# EAGLE design OakyWing-v0.1 (EAGLE 9.5.2)
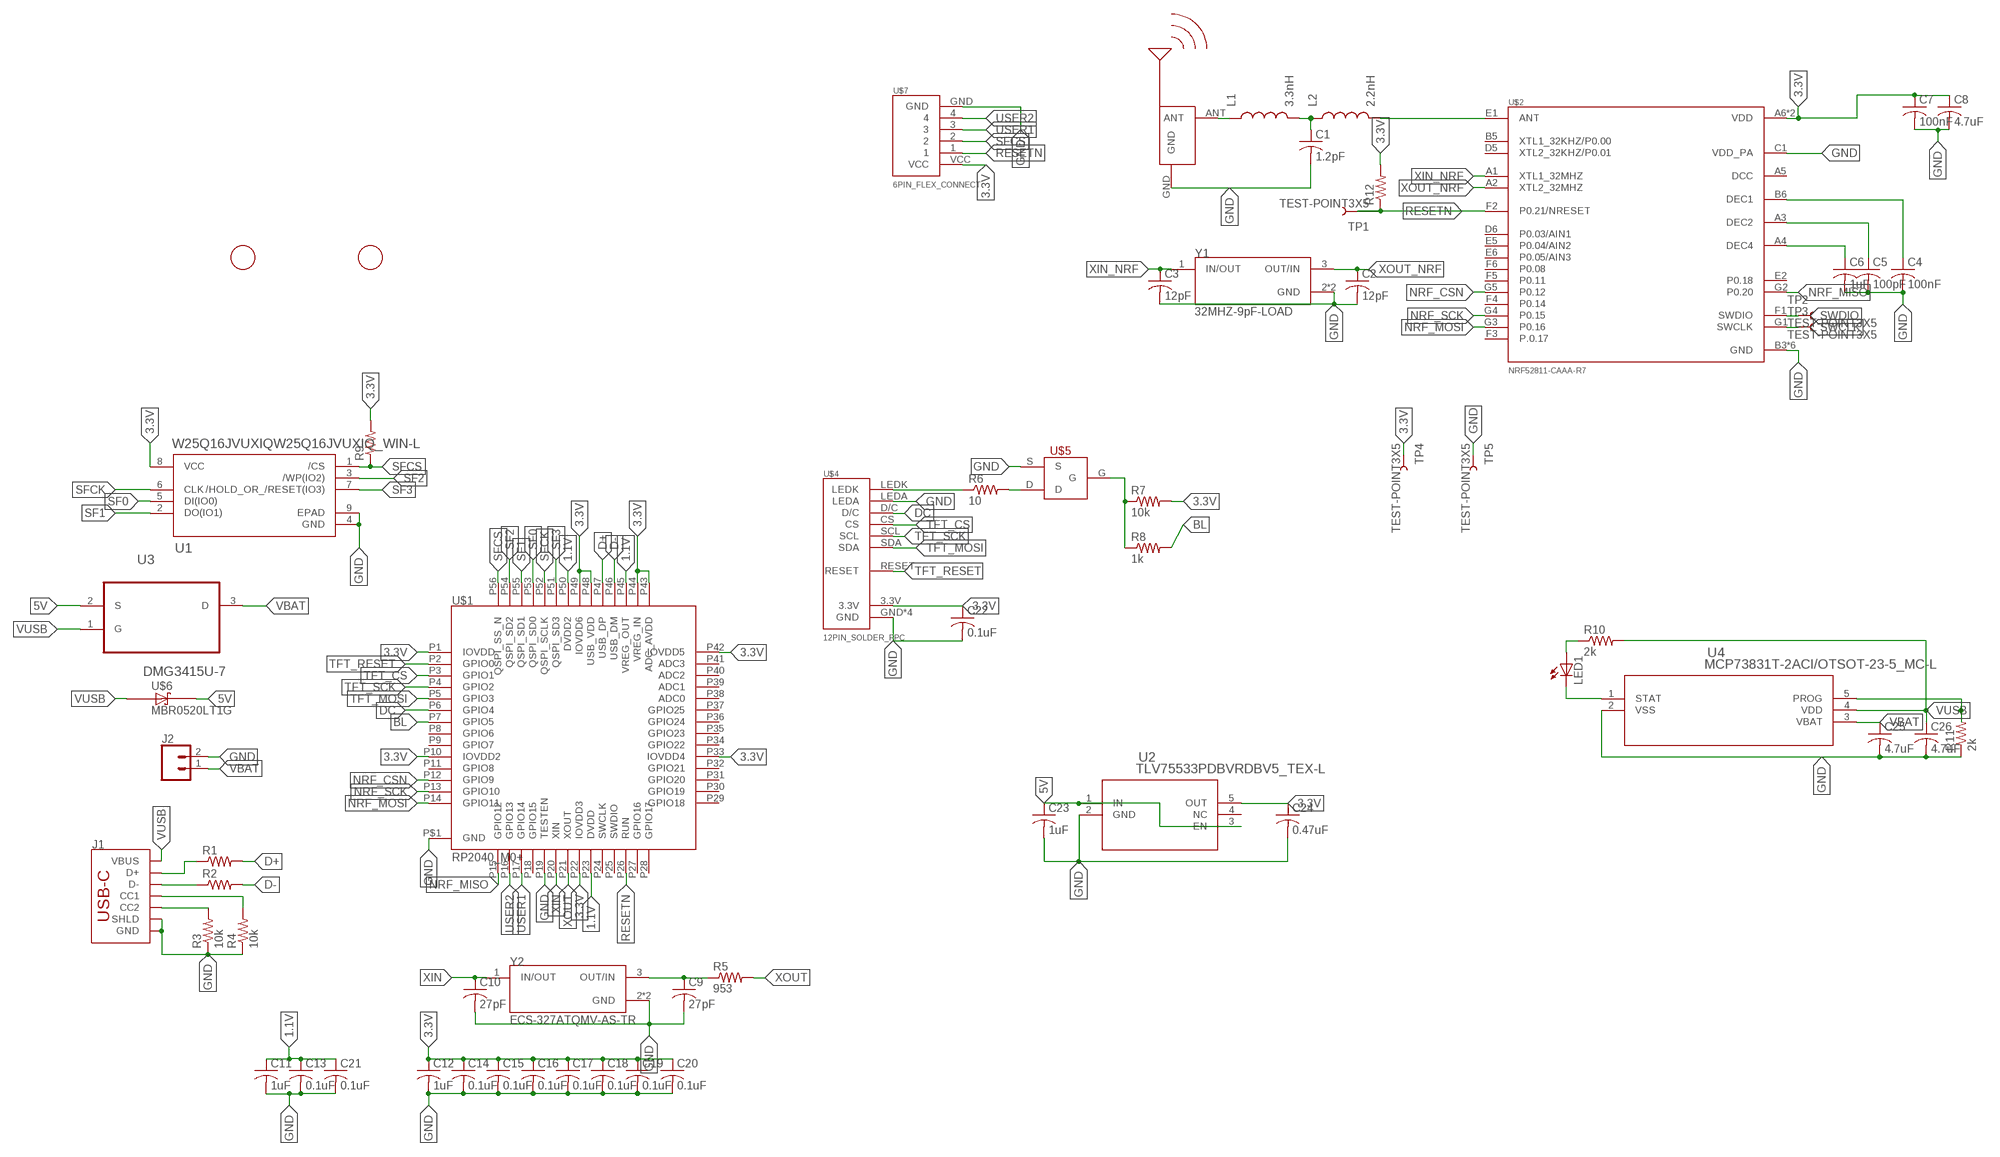
[diagram p0: schematic, sheet 1]

## Parts
C1  1.2pF  C-USC0402  [C0402]
C2  12pF  C-USC0402  [C0402]
C3  12pF  C-USC0402  [C0402]
C4  100nF  C-USC0402  [C0402]
C5  100pF  C-USC0402  [C0402]
C6  1uF  C-USC0402  [C0402]
C7  100nF  C-USC0402  [C0402]
C8  4.7uF  C-USC0603  [C0603]
C9  27pF  C-USC0402  [C0402]
C10  27pF  C-USC0402  [C0402]
C11  1uF  C-USC0402  [C0402]
C12  1uF  C-USC0402  [C0402]
C13  0.1uF  C-USC0402  [C0402]
C14  0.1uF  C-USC0402  [C0402]
C15  0.1uF  C-USC0402  [C0402]
C16  0.1uF  C-USC0402  [C0402]
C17  0.1uF  C-USC0402  [C0402]
C18  0.1uF  C-USC0402  [C0402]
C19  0.1uF  C-USC0402  [C0402]
C20  0.1uF  C-USC0402  [C0402]
C21  0.1uF  C-USC0402  [C0402]
C22  0.1uF  C-USC0402  [C0402]
C23  1uF  C-USC0402  [C0402]
C24  0.47uF  C-USC0402  [C0402]
C25  4.7uF  C-USC0603  [C0603]
C26  4.7uF  C-USC0603  [C0603]
J1  USB_C_2-LAYER_PADS  [USB-C-16P-2LAYER-PADS]
J2  CONN_02  [1X02]
L1  3.3nH  INDUCTOR  [R0402]
L2  2.2nH  INDUCTOR  [R0402]
LED1  LEDCHIP-LED0603  [CHIP-LED0603]
R1  R-US_R0603  [R0603]
R2  R-US_R0603  [R0603]
R3  10k  R-US_R0402  [R0402]
R4  10k  R-US_R0402  [R0402]
R5  953  R-US_R0402  [R0402]
R6  10  R-US_R0402  [R0402]
R7  10k  R-US_R0402  [R0402]
R8  1k  R-US_R0402  [R0402]
R9  R-US_R0402  [R0402]
R10  2k  R-US_R0603  [R0603]
R11  2k  R-US_R0603  [R0603]
R12  R-US_R0402  [R0402]
TP1  TEST-POINT3X5  [PAD.03X.05]
TP2  TEST-POINT3X5  [PAD.03X.05]
TP3  TEST-POINT3X5  [PAD.03X.05]
TP4  TEST-POINT3X5  [PAD.03X.05]
TP5  TEST-POINT3X5  [PAD.03X.05]
U1  W25Q16JVUXIQW25Q16JVUXIQ_WIN-L  [W25Q16JVUXIQ_WIN-L]
U2  TLV75533PDBVRDBV5_TEX-L  [DBV5_TEX-L]
U3  DMG3415U-7  [SOT95P240X105-3N]
U4  MCP73831T-2ACI/OTSOT-23-5_MC-L  [SOT-23-5_MC-L]
U$1  RP2040_M0+  [QFN-56]
U$2  NRF52811-CAAA-R7  [WLCSP]
U$3  BLE-2.45GHZ-ANTBLE-2.45GHZ-SERP-ANT  [2.45GHZ-SERPENTINE]
U$4  12PIN_SOLDER_FPC  [12PIN_SOLDER_FPC]
U$5  DMN65D8L-7  [SOT-23]
U$6  MBR0520LT1G  [SOD3716X117(SOD-123)]
U$7  6PIN_FLEX_CONNECT  [6PIN_0.7MM]
U$8  FIDUCIAL  [FIDUCIAL_1MM]
U$9  FIDUCIAL  [FIDUCIAL_1MM]
Y1  32MHZ-9pF-LOAD  ECS-327ATQMV-AS-TR  [XTAL_ECS-327ATQMV-AS-TR]
Y2  ECS-327ATQMV-AS-TR  [XTAL_ECS-327ATQMV-AS-TR]

## Nets
1.1V: C11.1 C13.1 C21.1 U$1.P23(DVDD) U$1.P45(VREG_OUT) U$1.P50(DVDD2)
3.3V: C7.1 C8.1 C12.1 C14.1 C15.1 C16.1 C17.1 C18.1 C19.1 C20.1 C22.1 C24.1 R7.2 R9.2 R12.2 TP4.P$1 U1.8(VCC) U2.5(OUT) U$1.P1(IOVDD) U$1.P10(IOVDD2) U$1.P22(IOVDD3) U$1.P33(IOVDD4) U$1.P42(IOVDD5) U$1.P43(ADC_AVDD) U$1.P44(VREG_IN) U$1.P48(USB_VDD) U$1.P49(IOVDD6) U$2.A6(VDD) U$2.G6(VDD) U$4.3.3V U$7.VCC
5V: C23.1 U2.1(IN) U2.3(EN) U3.2(S) U$6.1(C)
BL: R8.2 U$1.P7(GPIO5)
D+: R1.2 U$1.P47(USB_DP)
D-: R2.2 U$1.P46(USB_DM)
DC: U$1.P6(GPIO4) U$4.D/C
GND: C1.2 C2.2 C3.2 C4.2 C5.2 C6.2 C7.2 C8.2 C9.2 C10.2 C11.2 C12.2 C13.2 C14.2 C15.2 C16.2 C17.2 C18.2 C19.2 C20.2 C21.2 C22.2 C23.2 C24.2 C25.2 C26.2 J1.GND J1.GND2(GND) J1.P$1(SHLD) J1.P$2(SHLD) J1.P$3(SHLD) J1.P$4(SHLD) J1.SHLD1(SHLD) J1.SHLD2(SHLD) J1.SHLD3(SHLD) J1.SHLD4(SHLD) J2.2 R3.1 R4.1 R11.1 TP5.P$1 U1.4(GND) U1.9(EPAD) U2.2(GND) U4.2(VSS) U$1.P19(TESTEN) U$1.P$1(GND) U$2.B3(GND) U$2.B4(GND) U$2.C1(VDD_PA) U$2.D3(GND) U$2.D4(GND) U$2.E3(GND) U$2.E4(GND) U$3.GND U$4.GND U$4.GND2(GND) U$4.GND3(GND) U$4.GND4(GND) U$4.LEDA U$5.S U$7.GND Y1.2(GND) Y1.4(GND) Y2.2(GND) Y2.4(GND)
N$5: L2.2 U$2.E1(ANT)
N$6: C1.1 L1.2 L2.1
N$7: L1.1 U$3.ANT
N$8: C4.1 U$2.B6(DEC1)
N$9: C5.1 U$2.A3(DEC2)
N$11: C6.1 U$2.A4(DEC4)
N$12: C9.1 R5.1 Y2.3(OUT/IN)
N$13: J1.A6(D+) J1.B6(D+) R1.1
N$14: J1.A7(D-) J1.B7(D-) R2.1
N$15: J1.A5(CC1) R4.2
N$16: J1.B5(CC2) R3.2
N$17: R7.1 R8.1 U$5.G
N$18: R6.2 U$5.D
N$21: R6.1 U$4.LEDK
N$22: LED1.C U4.1(STAT)
N$23: R11.2 U4.5(PROG)
N$24: LED1.A R10.1
NRF_CSN: U$1.P12(GPIO9) U$2.G5(P0.12)
NRF_MISO: U$1.P15(GPIO12) U$2.G2(P0.20)
NRF_MOSI: U$1.P14(GPIO11) U$2.G3(P0.16)
NRF_SCK: U$1.P13(GPIO10) U$2.G4(P0.15)
RESETN: R12.1 TP1.P$1 U$1.P26(RUN) U$2.F2(P0.21/NRESET) U$7.1
SF0: U1.5(DI(IO0)) U$1.P53(QSPI_SD0)
SF1: U1.2(DO(IO1)) U$1.P55(QSPI_SD1)
SF2: U1.3(/WP(IO2)) U$1.P54(QSPI_SD2)
SF3: U1.7(/HOLD_OR_/RESET(IO3)) U$1.P51(QSPI_SD3)
SFCK: U1.6(CLK) U$1.P52(QSPI_SCLK)
SFCS: R9.1 U1.1(/CS) U$1.P56(QSPI_SS_N) U$7.2
SWCLK: TP3.P$1 U$2.G1(SWCLK)
SWDIO: TP2.P$1 U$2.F1(SWDIO)
TFT_CS: U$1.P3(GPIO1) U$4.CS
TFT_MOSI: U$1.P5(GPIO3) U$4.SDA
TFT_RESET: U$1.P2(GPIO0) U$4.RESET
TFT_SCK: U$1.P4(GPIO2) U$4.SCL
USER1: U$1.P17(GPIO14) U$7.3
USER2: U$1.P16(GPIO13) U$7.4
VBAT: C25.1 J2.1 U3.3(D) U4.3(VBAT)
VUSB: C26.1 J1.VBUS1(VBUS) J1.VBUS2(VBUS) R10.2 U3.1(G) U4.4(VDD) U$6.2(A)
XIN: C10.1 U$1.P20(XIN) Y2.1(IN/OUT)
XIN_NRF: C3.1 U$2.A1(XTL1_32MHZ) Y1.1(IN/OUT)
XOUT: R5.2 U$1.P21(XOUT)
XOUT_NRF: C2.1 U$2.A2(XTL2_32MHZ) Y1.3(OUT/IN)
Unconnected: U2.4(NC) U$1.P8(GPIO6) U$1.P9(GPIO7) U$1.P11(GPIO8) U$1.P18(GPIO15) U$1.P24(SWCLK) U$1.P25(SWDIO) U$1.P27(GPIO16) U$1.P28(GPIO17) U$1.P29(GPIO18) U$1.P30(GPIO19) U$1.P31(GPIO20) U$1.P32(GPIO21) U$1.P34(GPIO22) U$1.P35(GPIO23) U$1.P36(GPIO24) U$1.P37(GPIO25) U$1.P38(ADC0) U$1.P39(ADC1) U$1.P40(ADC2) U$1.P41(ADC3) U$2.A5(DCC) U$2.B5(XTL1_32KHZ/P0.00) U$2.D5(XTL2_32KHZ/P0.01) U$2.D6(P0.03/AIN1) U$2.E2(P0.18) U$2.E5(P0.04/AIN2) U$2.E6(P0.05/AIN3) U$2.F3(P.0.17) U$2.F4(P0.14) U$2.F5(P0.11) U$2.F6(P0.08)

## Library data of the parts
C1 C2 C4-C8 C22-C26 = rcl:C-US: CAPACITOR, American symbol; SPICEPREFIX: C
C3 C9-C21 = adafruit:C-US: CAPACITOR, American symbol
J1 = SparkFun-Connectors:USB_C: USB Type C 16Pin Connector Super Speed pins not available on the 16-pin purely SMD connector so this part is best for USB 2.0 implementations. D1 and D2 are tied together enabling D+/- no matter which way the cable is plugged into the connector. The two channel configuration pins (CC1/2) are exposed. These are normally connected to ground via 5.1k resistors but can be reconfigured for high current/high power applications.; PROD_ID: CONN-14122
J2 = SparkFun-Connectors:CONN_02: Multi connection point. Often used as Generic Header-pin footprint for 0.1 inch spaced/style header connections On any of the 0.1 inch spaced packages, you can populate with these: Break Away Headers - Straight <https://www.sparkfun.com/products/116> (PRT-00116) Break Away Male Headers - Right Angle <https://www.sparkfun.com/products/553> (PRT-00553) Female Headers <https://www.sparkfun.com/products/115> (PRT-00115) Break Away Headers - Machine Pin <https://www.sparkfun.com/products/117> (PRT-00117) Break Away Female Headers - Swiss Machine Pin <https://www.sparkfun.com/products/743> (PRT-00743) For SCREWTERMINALS and SPRING TERMINALS visit here: Screw Terimnals on SparkFun.com <https://www.sparkfun.com/search/results?term=Screw+Terminals> (5mm/3.5mm/2.54mm spacing) This device is also useful as a general connection point to wire up your design to another part of your project. Our various solder wires solder well into these plated through hole pads. Hook-Up Wire - Assortment (Stranded, 22 AWG) <https://www.sparkfun.com/products/11375> (PRT-11375) Hook-Up Wire - Assortment (Solid Core, 22 AWG) <https://www.sparkfun.com/products/11367> (PRT-11367) View the entire wire category on our website here <https://www.sparkfun.com/categories/141> Special notes: Molex polarized connector foot print use with: PRT-08233 with associated crimp pins and housings. 2.54_SCREWTERM for use with PRT-10571. 3.5mm Screw Terminal footprints for PRT-08084 5mm Screw Terminal footprints for use with PRT-08432
L1 L2 = Chip_Inductors:INDUCTOR
LED1 = adafruit:LED: LED OSRAM: - CHIPLED LG R971, LG N971, LY N971, LG Q971, LY Q971, LO R971, LY R971 LH N974, LH R974 LS Q976, LO Q976, LY Q976 LO Q996 - Hyper CHIPLED LW Q18S LB Q993, LB Q99A, LB R99A - SideLED LS A670, LO A670, LY A670, LG A670, LP A670 LB A673, LV A673, LT A673, LW A673 LH A674 LY A675 LS A676, LA A676, LO A676, LY A676, LW A676 LS A679, LY A679, LG A679 - Hyper Micro SIDELED® LS Y876, LA Y876, LO Y876, LY Y876 LT Y87S - SmartLED LW L88C, LW L88S LB L89C, LB L89S, LG L890 LS L89K, LO L89K, LY L89K LS L896, LA L896, LO L896, LY L896 - TOPLED LS T670, LO T670, LY T670, LG T670, LP T670 LSG T670, LSP T670, LSY T670, LOP T670, LYG T670 LG T671, LOG T671, LSG T671 LB T673, LV T673, LT T673, LW T673 LH T674 LS T676, LA T676, LO T676, LY T676, LB T676, LH T676, LSB T676, LW T676 LB T67C, LV T67C, LT T67C, LS T67K, LO T67K, LY T67K, LW E67C LS E67B, LA E67B, LO E67B, LY E67B, LB E67C, LV E67C, LT E67C LW T67C LS T679, LY T679, LG T679 LS T770, LO T770, LY T770, LG T770, LP T770 LB T773, LV T773, LT T773, LW T773 LH T774 LS E675, LA E675, LY E675, LS T675 LS T776, LA T776, LO T776, LY T776, LB T776 LHGB T686 LT T68C, LB T68C - Hyper Mini TOPLED® LB M676 - Mini TOPLED Santana® LG M470 LS M47K, LO M47K, LY M47K Source: http://www.osram.convergy.de/
R1 R2 R6-R12 = rcl:R-US_: RESISTOR, American symbol; SPICEPREFIX: R
R3-R5 = adafruit:R-US_: RESISTOR, American symbol
TP1-TP5 = SparkFun-Connectors:TEST-POINT: SparkFun Test Points Bare copper test points for troubleshooting or In-Circuit-Testing. These are used by our Production team for verifying production board runs using pogo-pins on test beds. SparkFun Products: SparkFun LSM9DS1 Breakout <https://www.sparkfun.com/products/13284> SparkFun PSOC <https://www.sparkfun.com/products/13714> SparkFun Load Cell Amplifier <https://www.sparkfun.com/products/13879>
U1 = Winbond SPI Flash:W25Q16JVUXIQ; BUILT_BY: EMA_Colton; COPYRIGHT: Copyright (C) 2018 Accelerated Designs. All rights reserved; DATASHEET: https://www.mouser.com/datasheet/2/949/w25n01gw_reve_021318_unsecured-1489855.pdf; MANUFACTURER_PART_NUMBER: W25Q16JVUXIQ; SOURCELIBRARY: Winbond_2020-03-18; VENDOR: Winbond
U2 = TLV75533pdbvr:TLV75533PDBVR; COPYRIGHT: Copyright (C) 2018 Accelerated Designs. All rights reserved; MANUFACTURER_PART_NUMBER: TLV75533PDBVR; SOURCELIBRARY: TI_2019-06-18; VENDOR: Texas Instruments
U3 = DMG3415U-7:DMG3415U-7: P-CHANNEL ENHANCEMENT MODE MOSFET; AVAILABILITY: Unavailable; DESCRIPTION: P-Channel 20V 4A _Ta_ 900mW _Ta_ Surface Mount SOT-23-3; MF: Diodes Inc.; MP: DMG3415U-7; PACKAGE: SOT-23-3 Diodes Inc.; PRICE: None
U4 = MCP73831-2ACI:MCP73831T-2ACI/OT; BUILT_BY: EMA_UL_Team; MANUFACTURER_PART_NUMBER: MCP73831T-2ACI/OT; VENDOR: Microchip
U$1 = RP2040_M0:RP2040_M0+
U$2 = Nordic Devices:NRF52811-CAAA-R7
U$3 = PCB Antennas:BLE-2.45GHZ-ANT
U$4 = GC9A01 Display Connectors:12PIN_SOLDER_FPC
U$5 = DMN65D8L-7:DMN65D8L-7
U$6 = MBR0520LT1G:MBR0520LT1G: Surface Mount Schottky Power Rectifier Plastic SOD−123 Package; AVAILABILITY: Unavailable; DESCRIPTION: Diode Schottky 20V 500mA Surface Mount SOD-123; MF: ON Semiconductor; MP: MBR0520LT1G; PACKAGE: SOD-123 ON Semiconductor; PRICE: None
U$7 = Flex Connectors:6PIN_FLEX_CONNECT
U$8 U$9 = adafruit:FIDUCIAL: For use by pick and place machines to calibrate the vision/machine, 1mm By microbuilder.eu
Y1 Y2 = ECS-327ATQMV-AS-TR:ECS-327ATQMV-AS-TR: The ECX-33Q is a miniature SMD Crystal with a 3.2 x 2.5 mm footprint. AEC-Q200 Qualified.; ARROW_ELECTRONICS-PURCHASE-URL: https://snapeda.com/shop?store=Arrow+Electronics&id=3210300; DESCRIPTION: 32.768kHz XO (Standard) CMOS Oscillator 1.62V ~ 3.63V Enable/Disable 4-SMD, No Lead; DIGI-KEY_PART_NUMBER: XC2826CT-ND; MF: ECS Inc.; MOUSER-PURCHASE-URL: https://snapeda.com/shop?store=Mouser&id=3210300; MP: ECS-327ATQMV-AS-TR; PACKAGE: SMD-4 ECS Inc.

## Board
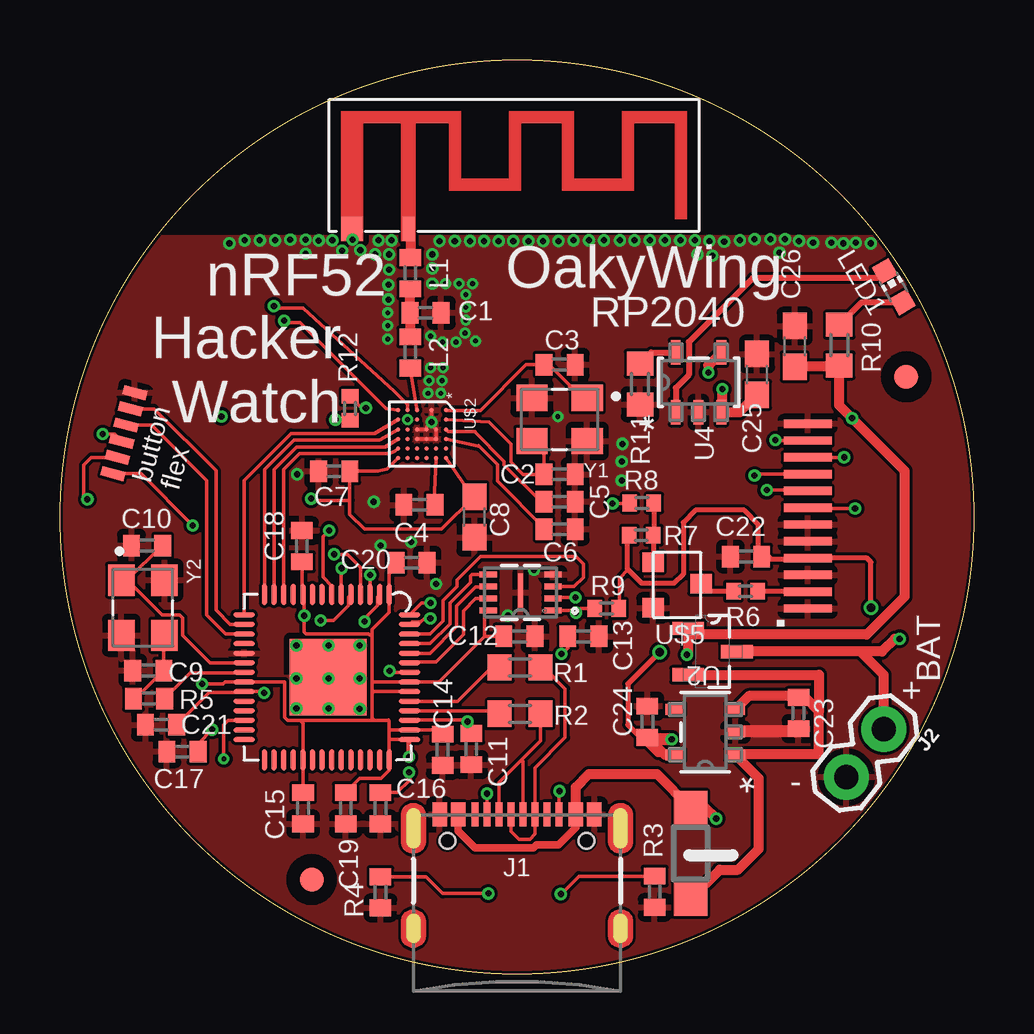
[diagram p1: board, top side]
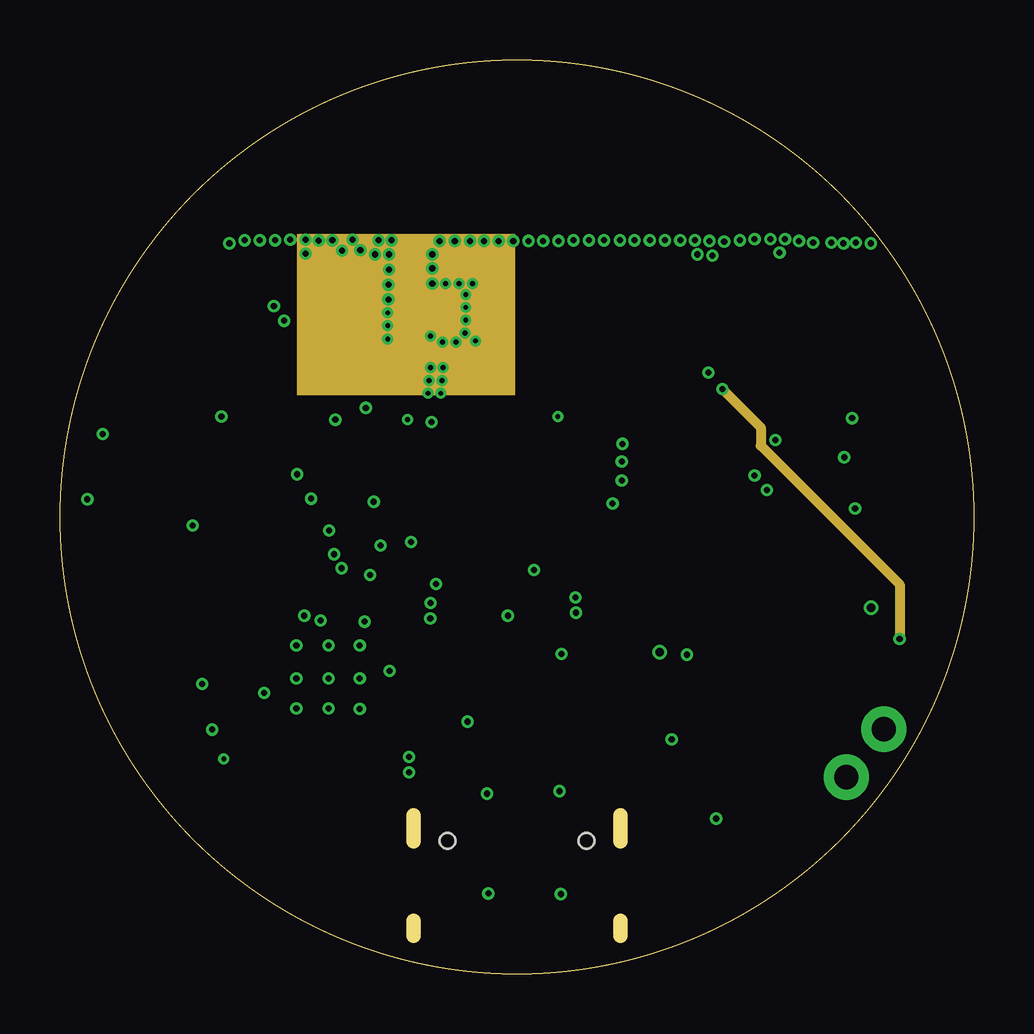
[diagram p2: board, inner layer Route2]
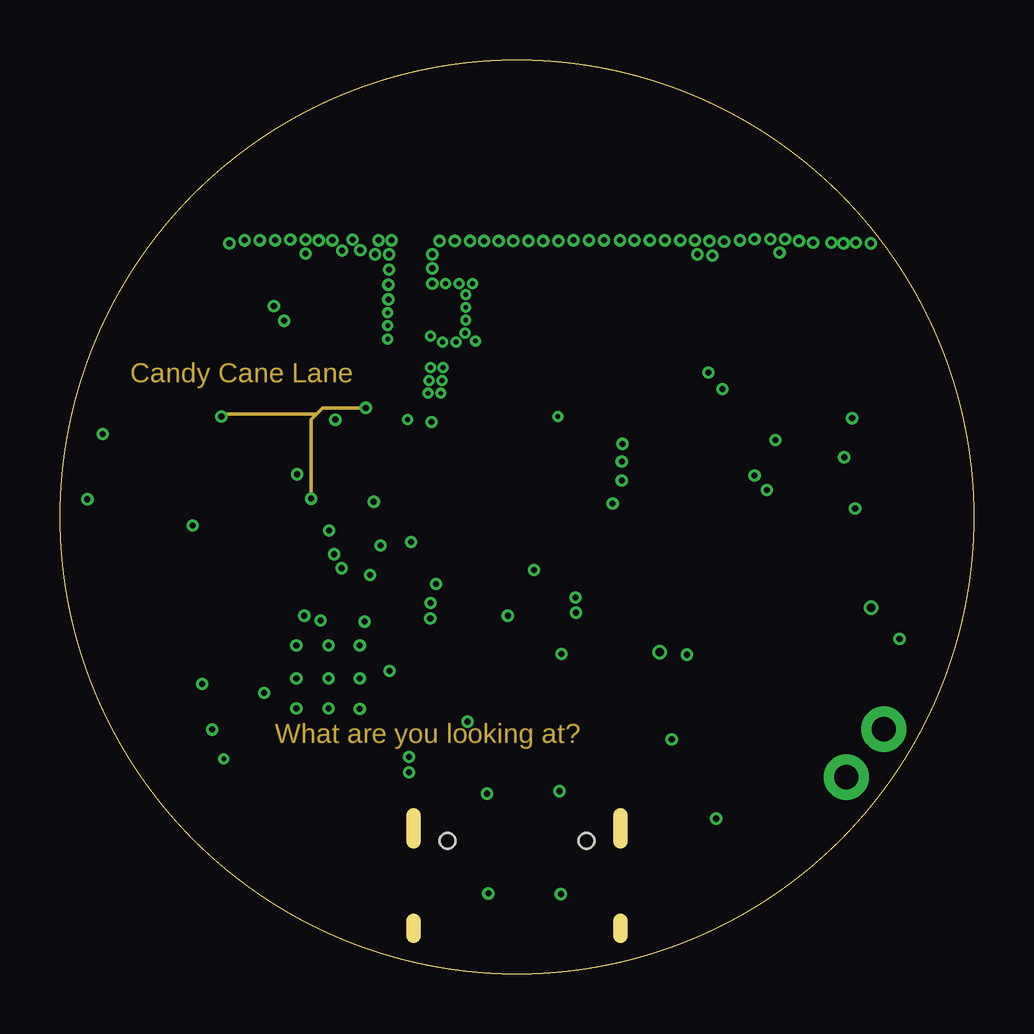
[diagram p3: board, inner layer Route15]
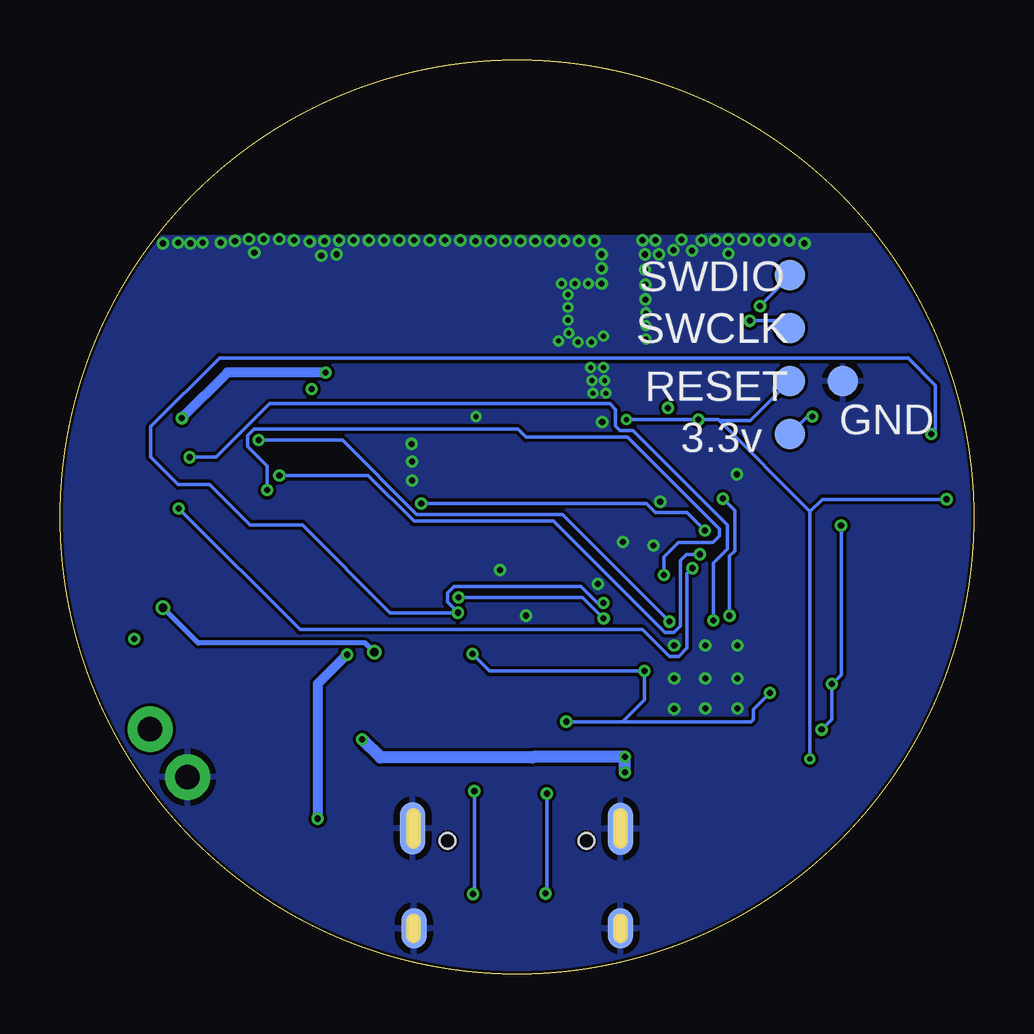
[diagram p4: board, bottom side, seen from below]

Size 38.1 x 38.1 mm. Coordinates in mm from the lower left corner, seen from the top.
Outline: circle at 19.05,19.05 radius 19.05
Copper layers (1+2*3+14*15+16): Top 0.04318125mm / dielectric 0.11074375mm / Route2 0.017271875mm / dielectric 4mil / Route3 0.017271875mm / dielectric 0.925575mm / Route14 0.017271875mm / dielectric 4mil / Route15 0.017271875mm / dielectric 0.11074375mm / Bottom 0.04318125mm
Design rules "default *": minimum track width 5mil, minimum drill 8mil, track to track 5mil, track to pad 5mil, pad to pad 5mil, via to via 5mil, smd to smd 5mil, copper to edge 5mil, drill to drill 5mil, minimum pad ring 4mil, minimum via ring 5mil, stop-mask expansion 3mil, vias tented up to drill 10mil, thermal gap 10mil

### Footprints (pad centres in the part's own frame; a part is rotated, then mirrored left to right if it is on the bottom)
C0402 = smd 0.7 x 0.9: 1 -0.65,0; 2 0.65,0
C0603 = smd 1.1 x 1: 1 -0.85,0; 2 0.85,0
USB-C-16P-2LAYER-PADS = smd 0.3 x 1: A5 -1.25,-0.34; A6 -0.25,-0.34; A7 0.25,-0.34; A8 1.25,-0.34; B5 1.75,-0.34; B6 0.75,-0.34; B7 -0.75,-0.34; B8 -1.75,-0.34 | smd 0.6 x 1: GND -3.225,-0.34; GND2 3.225,-0.34; VBUS1 -2.45,-0.34; VBUS2 2.45,-0.34 | smd 1.067 x 2.184 bottom: P$1 -4.318,-0.94; P$2 4.343,-0.914 | smd 1.067 x 1.676 bottom: P$3 -4.318,-5.08; P$4 4.293,-5.08 | drill 0.4 pad 0.6 long: SHLD1 -4.318,-0.915; SHLD2 4.318,-0.915; SHLD3 -4.318,-5.095; SHLD4 4.318,-5.095 | hole 0.65: -2.89,-1.445; 2.89,-1.445
1X02 = drill 1.016 pad 1.88: 1 0,0; 2 2.54,0
R0402 = smd 0.7 x 0.9: 1 -0.65,0; 2 0.65,0
CHIP-LED0603 = smd 0.8 x 0.8: A 0,-0.75; C 0,0.75
R0603 = smd 1 x 1.1: 1 -0.85,0; 2 0.85,0
R0402' = smd 0.6 x 0.7: 1 -0.5,0; 2 0.5,0
PAD.03X.05 = smd 1.27 x 1.27: P$1 0,0
W25Q16JVUXIQ_WIN-L = smd 0.711 x 0.254: 1 -1.348,0.75; 2 -1.348,0.25; 3 -1.348,-0.25; 4 -1.348,-0.75; 5 1.348,-0.75; 6 1.348,-0.25; 7 1.348,0.25; 8 1.348,0.75 | smd 0.203 x 1.6: 9 0,0
DBV5_TEX-L = smd 0.775 x 0.457: 1 -1.264,0.95; 2 -1.264,0; 3 -1.264,-0.95; 4 1.264,-0.95; 5 1.264,0.95
SOT95P240X105-3N = smd 1.321 x 0.559: 1 -1.016,0.965; 2 -1.016,-0.965; 3 1.016,0
SOT-23-5_MC-L = smd 1.016 x 0.406: 1 -1.245,0.95; 2 -1.245,0; 3 -1.245,-0.95; 4 1.245,-0.95; 5 1.245,0.95
QFN-56 = smd 0.875 x 0.2: P1 -3.5,2.55; P2 -3.5,2.15; P3 -3.5,1.75; P4 -3.5,1.35; P5 -3.5,0.95; P6 -3.5,0.55; P7 -3.5,0.15; P8 -3.5,-0.25; P9 -3.5,-0.65; P10 -3.5,-1.05; P11 -3.5,-1.45; P12 -3.5,-1.85; P13 -3.5,-2.25; P14 -3.5,-2.65; P29 3.4,-2.65; P30 3.4,-2.25; P31 3.4,-1.85; P32 3.4,-1.45; P33 3.4,-1.05; P34 3.4,-0.65; P35 3.4,-0.25; P36 3.4,0.15; P37 3.4,0.55; P38 3.4,0.95; P39 3.4,1.35; P40 3.4,1.75; P41 3.4,2.15; P42 3.4,2.55 | smd 0.2 x 0.875: P15 -2.65,-3.5; P16 -2.25,-3.5; P17 -1.85,-3.5; P18 -1.45,-3.5; P19 -1.05,-3.5; P20 -0.65,-3.5; P21 -0.25,-3.5; P22 0.15,-3.5; P23 0.55,-3.5; P24 0.95,-3.5; P25 1.35,-3.5; P26 1.75,-3.5; P27 2.15,-3.5; P28 2.55,-3.5; P43 2.55,3.4; P44 2.15,3.4; P45 1.75,3.4; P46 1.35,3.4; P47 0.95,3.4; P48 0.55,3.4; P49 0.15,3.4; P50 -0.25,3.4; P51 -0.65,3.4; P52 -1.05,3.4; P53 -1.45,3.4; P54 -1.85,3.4; P55 -2.25,3.4; P56 -2.65,3.4 | smd 3.2 x 3.2: P$1 -0.05,0
WLCSP = smd 0.19 x 0.19: A1 0.5,2.75; A2 0.9,2.75; A3 1.3,2.75; A4 1.7,2.75; A5 2.1,2.75; A6 2.5,2.75; B3 1.3,2.35; B4 1.7,2.35; B5 2.1,2.35; B6 2.5,2.35; C1 0.5,2.15; D3 1.3,1.95; D4 1.7,1.95; D5 2.1,1.95; D6 2.5,1.95; E1 0.5,1.55; E2 0.9,1.55; E3 1.3,1.55; E4 1.7,1.55; E5 2.1,1.55; E6 2.5,1.55; F1 0.5,1.15; F2 0.9,1.15; F3 1.3,1.15; F4 1.7,1.15; F5 2.1,1.15; F6 2.5,1.15; G1 0.5,0.75; G2 0.9,0.75; G3 1.3,0.75; G4 1.7,0.75; G5 2.1,0.75; G6 2.5,0.75
2.45GHZ-SERPENTINE = smd 0.5 x 1: ANT -0.1,0.5 | smd 0.9 x 1: GND -2.45,0.5
12PIN_SOLDER_FPC = smd 0.35 x 2: 3.3V -0.7,0.7; CS 2.1,0.7; D/C 1.4,0.7; GND -2.8,0.7; GND2 0,0.7; GND3 0.7,0.7; GND4 4.9,0.7; LEDA -1.4,0.7; LEDK -2.1,0.7; RESET 4.2,0.7; SCL 2.8,0.7; SDA 3.5,0.7
SOT-23 = smd 0.8 x 0.9: D -0.011,1.017; G -0.911,-0.983; S 0.989,-0.983
SOD3716X117(SOD-123) = smd 1.4 x 1.4: 1 -1.9,0.051; 2 1.9,0.051
6PIN_0.7MM = smd 0.4 x 1: 1 -1.4,0; 2 -0.7,0; 3 0,0; 4 0.7,0; GND 1.4,0; VCC -2.1,0
FIDUCIAL_1MM = smd 1 x 1: 1 0,0
XTAL_ECS-327ATQMV-AS-TR = smd 1.3 x 1.1: 1 -1.15,-0.9; 2 1.15,-0.9; 3 1.15,0.9; 4 -1.15,0.9

### Placement (x,y rotation side)
C1  15.24,27.56 0 top
C2  20.83,20.83 0 top
C3  20.83,25.4 0 top
C4  14.99,19.56 180 top
C5  20.83,19.68 0 top
C6  20.83,18.54 0 top
C7  11.43,20.95 180 top
C8  17.27,19.05 270 top
C9  3.68,12.65 180 top
C10  3.63,17.86 180 top
C11  17.14,9.37 270 top
C12  19.15,14.07 0 top
C13  21.82,14.07 0 top
C14  15.95,9.35 270 top
C15  10.13,6.91 270 top
C16  13.36,6.91 270 top
C17  5.11,9.27 180 top
C18  10.08,17.83 90 top
C19  11.91,6.91 270 top
C20  14.66,17.14 0 top
C21  4.22,10.39 180 top
C22  28.6,17.4 180 top
C23  30.78,10.87 270 top
C24  24.49,10.52 90 top
C25  29.06,24.99 90 top
C26  30.63,26.16 90 top
J1  19.05,6.99 0 top
J2  34.34,10.21 232 top
L1  14.61,29.21 270 top
L2  14.61,25.91 270 top
LED1  34.76,28.65 30 top
R1  19.18,12.78 180 top
R2  19.18,10.85 180 top
R3  24.79,3.43 90 top
R4  13.36,3.4 90 top
R5  3.71,11.48 0 top
R6  10  [R0402']  28.57,15.95 180 top
R7  10k  [R0402']  24.23,18.29 180 top
R8  1k  [R0402']  24.26,19.63 180 top
R9  [R0402']  22.78,15.24 0 top
R10  32.49,26.21 270 top
R11  24.18,24.59 90 top
R12  [R0402']  12.09,23.57 90 top
TP1  7.67,24.71 0 bottom
TP2  7.67,29.13 0 bottom
TP3  7.67,26.92 0 bottom
TP4  7.67,22.5 0 bottom
TP5  5.46,24.71 0 bottom
U1  19.2,15.9 180 top
U2  26.9,10.08 180 top
U3  27.2,13.44 0 top
U4  26.62,24.66 90 top
U$1  11.18,12.32 270 top
U$2  13.34,24 270 top
U$3  14.63,30.55 0 top
U$4  31.88,18.03 90 top
U$5  25.7,16.26 270 top
U$6  26.34,5.03 90 top
U$7  2.76,22.88 75 top
U$8  35.28,24.89 0 top
U$9  10.49,3.94 0 top
Y1  20.83,23.11 180 top
Y2  3.45,15.27 270 top

### Tracks (layer width: path | path; a pad name or v marks a point on that pad's centre or on a via)
1.1V  (via drill 0.25)
  Top 0.152: U$1.P45 14.6,10.59 16.92,10.59 v16.99,10.52 17.14,10.36 C11.1 | C21.1 6.21,11.73 7.64,11.73 U$1.P23 8.45,11.77 v8.51,11.71 | v13.74,12.63 13.8,12.57 U$1.P50 | C13.1 21.17,13.6 v20.91,13.34
  Bottom 0.152: v8.51,11.71 9.2,11.03 9.2,10.62 9.3,10.52 14.66,10.52 | 14.66,10.52 v16.99,10.52 | 14.66,10.52 13.74,11.43 v13.74,12.63 20.2,12.63 v20.91,13.34
3.3V  (via drill 0.25, 0.35)
  Top 0.152: 12.28,21.16 C7.1 | U$2.G6 13.63,21.05 13.26,20.95 C7.1 | U$2.A6 17.19,19.9 C8.1 15.91,18.54 12.7,18.54 12.08,19.16 12.08,19.74 | 12.08,19.74 C7.1 | 10.01,10.57 9.49,10.57 9.37,10.69 9.37,12.17 U$1.P22 6.89,12.17 6.81,12.09 v5.92,12.09 | 10.01,10.57 10.13,10.45 U$1.P33 C15.1 | 10.01,10.57 13.11,10.57 | 13.11,10.57 13.66,10.57 13.69,10.59 13.73,10.56 13.73,10.13 | 13.73,10.13 13.73,9.78 | 13.73,9.78 U$1.P42 13.73,8.49 13.39,8.15 12.5,8.15 C19.1 | U$1.P43 14.55,9.77 13.74,9.77 13.73,9.78 | 13.73,10.13 13.76,10.17 U$1.P44 15.78,10.17 C14.1 15.72,9.77 | 13.11,10.57 13.01,10.67 13.01,11.68 | 13.01,11.68 13.01,12.17 | 13.01,12.17 13.01,14.12 | 13.01,14.12 13.01,14.35 13.73,15.07 U$1.P1 13.73,16.67 14.01,16.95 C20.1 | 13.01,14.12 12.91,14.12 12.86,14.17 10.26,14.17 10.19,14.25 v10.19,14.94 10.19,15.76 U$1.P10 10.08,15.86 C18.1 | 13.01,12.17 U$1.P49 15.8,12.17 17.7,14.07 | U$1.P48 13.09,11.77 13.01,11.68 | 13.36,7.59 C16.1 14.06,7.56 14.58,8.07 | 13.36,7.59 13.36,7.67 | 13.32,7.56 13.36,7.59 | C12.1 17.7,14.07 | 17.7,14.07 17.7,15 U1.8 | C17.1 5.75,9.59 v6.35,10.19 | 12.08,19.74 10.54,19.74 v10.46,19.81 | R9.2 23.32,15.27 23.32,16.48 23.69,16.85 | U$7.VCC 3.38,20.85 v5.54,18.69 | v12.75,23.6 12.56,23.6 R12.2
  Top 0.203: U2.5 24.92,9.13 23.67,10.38 23.67,12.09 v24.99,13.41 | v33.81,15.27 33.81,17.17 33.64,17.33 U$4.3.3V 31.14,17.3 29.64,17.3 29.39,17.54 C22.1 29.11,17.54 29.11,18.75 28.52,19.33 26.49,19.33 25.98,18.82 25.98,16.66 25.6,16.28 24.26,16.28 23.69,16.85 23.65,16.89 23.65,18.2 R7.2 | 14.58,8.07 14.58,8.39 v14.55,8.41 | v14.55,9.04 14.55,9.77
  Top 0.406: U2.5 25.22,9.13 C24.1
  Top 0.508: v25.5,9.78 24.57,9.78 C24.1
  Route15 0.152: v10.46,19.81 10.46,23.11 10.69,23.34 | v12.75,23.6 10.95,23.6 10.69,23.34 | 10.69,23.34 6.83,23.34 v6.73,23.24
  Bottom 0.152: v6.35,10.19 5.92,10.61 v5.92,12.09 5.54,12.47 v5.54,18.69 | v10.19,14.94 10.19,17.42 9.97,17.63 9.97,19.32 v10.46,19.81 | v6.73,23.24 6.93,23.24 TP4.P$1
  Bottom 0.203: v24.99,13.41 25.38,13.79 32.33,13.79 v33.81,15.27
  Bottom 0.508: v14.55,8.41 v14.55,9.04 18.39,9.04 18.41,9.02 24.74,9.02 v25.5,9.78
5V
  Top 0.406: U2.3 28.71,11.58 30.79,11.58 C23.1 31.06,11.52 31.64,10.94 | 31.64,10.94 31.64,9.16 28.39,9.16 28.36,9.13 U2.1 29.13,8.16 29.13,5.21 28.27,4.34 27.5,4.34 U$6.1 | U3.2 31.64,12.47 31.64,10.94
BL  (via drill 0.25)
  Top 0.152: U$1.P7 11.33,16.18 10.97,16.55 10.97,18.24 v11.22,18.49 | v23.04,19.61 23.73,19.61 R8.2
  Bottom 0.152: v23.04,19.61 13.65,19.61 13.27,19.23 11.96,19.23 v11.22,18.49
D+
  Top 0.152: U$1.P47 16.58,11.37 17.98,12.78 R1.2
D-
  Top 0.152: U$1.P46 16.63,10.97 16.64,10.97 18.2,10.97 R2.2
DC  (via drill 0.25)
  Top 0.152: U$1.P6 11.73,16.9 v11.74,16.91 | v33.15,19.41 31.2,19.41 U$4.D/C
  Bottom 0.152: v11.74,16.91 11.96,16.69 11.96,13.58 12.31,13.23 12.69,13.23 13.81,14.36 28.1,14.36 v33.15,19.41
GND  (via drill 0.2, 0.25)
  Top 0.127: U$1.P$1 10.79,12.7
  Top 0.152: U$2.C1 v15.49,23.01 | v15.49,23.01 15.29,22.8 U$2.D3 U$2.E3 | U$2.E4 U$2.D4 U$2.B4 U$2.B3 15.49,22.89 v15.49,23.01
  Top 0.406: U$3.GND 12.19,31.04 v12.19,30.61 | 10.82,12.73 10.79,12.7 10.64,12.55 10.64,11.63 v11.2,11.07
  Top 0.508: C23.2 30.67,10.11 28.19,10.11 U2.2
  other vias: 13.08,19.68 19.76,16.84 9.86,13.69 11.2,13.69 12.5,13.69 12.5,12.32 12.5,11.05 9.86,11.07 23.42,20.57 23.42,21.36 23.44,22.1 13.36,17.86 14.63,18.01 15.67,16.26 9.88,20.83 18.67,14.94 9.86,12.32 11.2,12.32 13.69,28.12 13.69,28.73 13.72,29.36 13.72,30 13.82,30.58 13.28,30.58 11.35,30.58 10.79,30.58 10.24,30.61 9.6,30.61 8.97,30.58 8.33,30.58 7.7,30.58 12.52,30.18 10.24,30.02 7.06,30.45 11.76,30.15 13.13,30 15.52,28.78 15.52,29.41 15.52,30 15.82,30.56 16.46,30.56 17.09,30.56 17.68,30.56 18.29,30.56 18.9,30.56 19.53,30.56 20.14,30.56 20.78,30.56 21.41,30.58 22.05,30.58 22.68,30.58 23.34,30.58 23.95,30.58 24.59,30.58 25.22,30.58 25.86,30.58 26.47,30.58 27.08,30.56 27.69,30.53 28.96,30.63 29.62,30.63 31.39,30.48 32.66,30.45 30,30.07 26.57,30 27.2,29.95 32.16,30.48 30.81,30.56 30.23,30.63 28.35,30.58 33.17,30.48 33.81,30.45 20.75,23.24 15.88,24.21 15.34,24.21 15.39,24.74 15.93,24.74 15.98,25.27 15.44,25.27 13.67,27.56 13.67,27.03 13.67,26.47 15.44,26.59 15.95,26.34 16.51,26.34 16.89,26.72 17.32,26.39 16.92,27.25 16.92,27.79 16.92,28.32 17.2,28.78 16.64,28.78 16.08,28.78
  pour Top: 0,30.73 38.1,30.73 38.1,0 0,0
  pour Bottom: 38.1,30.73 11.18,30.73 11.18,30.81 0,30.81 0,0 38.1,0
N$5
  Top 0.152: U$2.E1 14.59,25.24 L2.2
N$6
  Top 0.406: L2.1 14.61,27.54 C1.1 14.59,28.55 L1.2
N$7
  Top 0.406: U$3.ANT 14.61,30.98 L1.1
N$8
  Top 0.152: C4.1 15.59,19.61 U$2.B6
N$9
  Top 0.152: U$2.A3 16.19,22.6 17.29,22.6 17.3,22.58 18.52,21.36 18.52,21.22 20.05,19.68 C5.1
N$11
  Top 0.152: U$2.A4 17.43,22 17.45,22.03 18.24,21.25 18.24,20.54 20.18,18.6 C6.1
N$12
  Top 0.152: R5.1 3.17,11.48 C9.1 4.33,14.09 Y2.3
N$13
  Top 0.152: J1.A6 18.8,5.94 19.13,5.61 19.58,5.61 19.8,5.83 J1.B6 19.8,8.6 21.06,9.86 21.06,11.89 20.17,12.78 R1.1
N$14
  Top 0.152: R2.1 20.03,9.71 19.24,8.93 | J1.B7 18.3,7.99 19.24,8.93 | J1.A7 19.3,8.87 19.24,8.93
N$15  (via drill 0.25)
  Top 0.152: J1.A5 v17.8,7.51 v17.8,7.52 | v17.86,3.35 15.95,3.35 15.25,4.05 R4.2
  Bottom 0.152: v17.8,7.52 17.8,3.4 v17.86,3.35
N$16  (via drill 0.25)
  Top 0.152: J1.B5 20.8,7.59 v20.83,7.62 | v20.88,3.33 21.63,4.08 R3.2
  Bottom 0.152: v20.83,7.62 20.83,3.4 20.88,3.35 v20.88,3.33
N$17
  Top 0.203: R8.1 24.76,18.31 R7.1 24.73,17.18 U$5.G
N$18
  Top 0.203: R6.2 27.04,15.95 U$5.D
N$21
  Top 0.203: U$4.LEDK 29.09,15.93 R6.1
N$22
  Top 0.254: LED1.C 34.09,29.01 28.88,29.01 26.21,26.34 26.21,24.97 25.67,24.43 U4.1
N$23
  Top 0.254: R11.2 24.65,25.91 U4.5
N$24
  Top 0.254: R10.1 33.42,28 LED1.A
NRF_CSN
  Top 0.152: U$2.G5 13.97,21.79 13.7,21.68 13.69,21.69 9.98,21.69 9.33,21.04 U$1.P12
NRF_MISO
  Top 0.152: U$2.G2 13.11,22.53 9.63,22.53 7.68,20.57 U$1.P15
NRF_MOSI
  Top 0.152: U$2.G3 13.33,22.25 9.75,22.25 8.53,21.03 U$1.P14
NRF_SCK
  Top 0.152: U$2.G4 13.55,21.97 9.87,21.97 8.93,21.03 U$1.P13
RESETN  (via drill 0.2, 0.25)
  Top 0.152: U$2.F2 | v6.83,8.97 6.83,10.39 7.01,10.57 U$1.P26 | U$7.1 1.31,21.53 0.99,21.21 0.99,19.94 v1.14,19.79 | R12.1 12.06,23.1 v11.48,23.1
  Bottom 0.152: U$2.F2 v11.48,23.1 10.66,23.1 10.62,23.06 | 6.83,19.28 v6.83,8.97 | 10.62,23.06 6.83,19.28 | v1.14,19.79 6.33,19.79 6.83,19.28 | TP1.P$1 9.32,23.06 10.62,23.06
  other vias: 14.49,23.1
SF0
  Top 0.152: U$1.P53 15.43,13.77 16.26,14.59 16.26,15.46 17.12,16.32 17.12,16.59 17.18,16.65 U1.5
SF1  (via drill 0.25)
  Top 0.152: U$1.P55 14.67,14.67 15.04,14.67 15.19,14.81 v15.44,14.81 | v21.49,15.69 20.59,15.69 U1.2
  Bottom 0.152: v15.44,14.81 16.31,15.69 v21.49,15.69
SF2
  Top 0.152: U$1.P54 15.44,14.17 15.98,14.71 15.98,15.57 16.56,16.16 16.56,16.42 17.54,17.4 21.51,17.4 21.82,17.09 21.82,16.54 21.43,16.15 U1.3
SF3
  Top 0.152: U$1.P51 14.61,13.01 15.67,13.01 16.82,14.15 16.82,15.14 17.33,15.65 U1.7
SFCK
  Top 0.152: U1.6 17.83,16.13 17.32,16.13 16.54,15.34 16.54,14.48 15.43,13.37 U$1.P52
SFCS  (via drill 0.25)
  Top 0.152: U$1.P56 15.08,15.47 v15.44,15.47 | U1.1 21.42,15.15 v21.51,15.06 21.7,15.24 R9.1 | v1.78,22.5 2.28,22.5 U$7.2
  Bottom 0.152: v15.44,15.47 15.69,15.47 16.38,16.15 21.68,16.15 21.95,15.88 21.95,15.5 21.51,15.07 v21.51,15.06 24.33,15.06 27.99,18.72 30.18,18.72 31.85,20.4 33.17,20.4 34.31,21.54 34.31,22.81 31.45,25.68 2.74,25.68 1.6,24.54 1.6,22.68 v1.78,22.5
SWCLK  (via drill 0.25)
  Top 0.152: v9.35,27.23 9.42,27.15 10.01,27.15 13.59,23.57 U$2.G1
  Bottom 0.152: TP3.P$1 7.98,27.23 v9.35,27.23
SWDIO  (via drill 0.25)
  Top 0.152: U$2.F1 14.48,23.73 13.94,24.27 10.13,27.76 8.99,27.76 v8.91,27.84
  Bottom 0.152: v8.91,27.84 7.67,29.08 TP2.P$1
TFT_CS  (via drill 0.25)
  Top 0.152: U$1.P3 v12.93,16.63 v12.93,16.64 | v29.46,20.17 31.14,20.17 U$4.CS
  Bottom 0.152: v12.93,16.64 12.93,17.37 12.32,17.98 10.88,17.98 10.61,18.25 10.61,18.55 14.43,22.38 18.67,22.38 19,22.71 30.01,22.71 30.28,22.44 30.28,21.98 29.46,21.17 v29.46,20.17
TFT_MOSI  (via drill 0.25)
  Top 0.152: U$1.P5 12.03,15.72 12.03,15.36 11.4,14.73 v10.87,14.73 | v32.69,21.54 v32.69,21.53 U$4.SDA
  Bottom 0.152: v32.69,21.54 31.6,21.54 29.36,23.77 15.18,23.77 14.94,23.53 14.94,22.84 14.76,22.66 14.22,22.66 10.28,18.71 10.28,17.73 10.87,17.14 v10.87,14.73
TFT_RESET  (via drill 0.25)
  Top 0.152: U$4.RESET 29.84,22.23 v29.82,22.25 | U$1.P2 13.23,15.72 13.23,15.36 12.69,14.82 v12.69,14.69
  Bottom 0.152: v12.69,14.69 17.16,19.15 23.23,19.15 26.33,22.25 v29.82,22.25
TFT_SCK  (via drill 0.25)
  Top 0.152: U$4.SCL 29.01,20.83 v28.96,20.78 | v11.42,17.5 11.98,17.5 12.53,16.95 U$1.P4
  Bottom 0.152: v28.96,20.78 25.25,20.78 23.34,18.87 17.53,18.87 12.88,14.23 12.51,14.23 12.24,14.5 12.24,17.24 11.98,17.5 v11.42,17.5
USER1
  Top 0.152: U$1.P17 6.91,14.17 6.12,14.96 6.12,20.57 3.81,22.88 U$7.3
USER2
  Top 0.152: U$1.P16 7.1,14.57 6.5,15.16 6.5,20.98 3.93,23.56 U$7.4
VBAT  (via drill 0.25)
  Top 0.406: J2.1 34.34,12.47 33.37,13.44 U3.3 34.27,13.44 34.8,13.97 v35,13.97 | C25.1 28.33,23.42 U4.3 27.61,23.46 v27.61,24.38
  Route2 0.406: v27.61,24.38 29.21,22.78 29.21,22.02 35,16.23 v35,13.97
VUSB  (via drill 0.25)
  Top 0.305: J1.VBUS1 16.6,5.96 17.3,5.26 19.73,5.26 19.86,5.38 20.78,5.38 21.5,6.11 J1.VBUS2
  Top 0.406: J1.VBUS2 21.5,7.78 22.05,8.33 24.89,8.33 U$6.2 26.9,6.93 v27.36,6.48 | v26.14,13.31 26.19,13.36 U3.1 26.44,14.15 33.63,14.15 35.2,15.72 35.2,20.98 v33.02,23.16 32.49,23.7 R10.2 32.44,25.31 C26.1 | U4.4 27.03,25.36 v27.03,25.07
  Bottom 0.406: v26.14,13.31 27.36,12.09 v27.36,6.48 | v27.03,25.07 31.11,25.07 v33.02,23.16
XIN
  Top 0.152: U$1.P20 6.26,12.97 5.11,14.12 5.11,14.85 4.99,14.97 4.26,14.97 2.81,16.41 | 2.81,16.41 Y2.1 | C10.1 4.25,17.86 2.81,16.41
XIN_NRF
  Top 0.127: 16.19,23.5 U$2.A1
  Top 0.152: U$2.A1 16.19,23.5 17.53,23.5 19.43,25.4 C3.1 20.39,25.4 21.3,24.49 21.25,24.49 21.72,24.01 Y1.1
XOUT
  Top 0.152: R5.2 5.42,12.55 7.66,12.55 U$1.P21
XOUT_NRF
  Top 0.152: Y1.3 20.18,21.71 C2.1 19.3,20.83 18.8,21.34 18.8,22.1 17.89,23 U$2.A2
(copper drawn outside any net)
  shapes: Route2 area x1

### Text on the board
Route3: Did you miss something?
Route14: Hidden Message | Resist | Fight For Good
Route15: Candy Cane Lane | What are you looking at?
tPlace: button / flex | BAT | + | -
tNames: OakyWing | nRF52 | Hacker / Watch | RP2040
bNames: SWDIO | SWCLK | RESET | GND | 3.3v